# Altium schematic sheet Analog_Section.SchDoc
size 353 x 250 mm; Date: 17.10.2024r.; Author: Bartłomiej Smoter; CompanyName: AGH Racing; Revision: v1; SheetNumber: 5; SheetTotal: 6
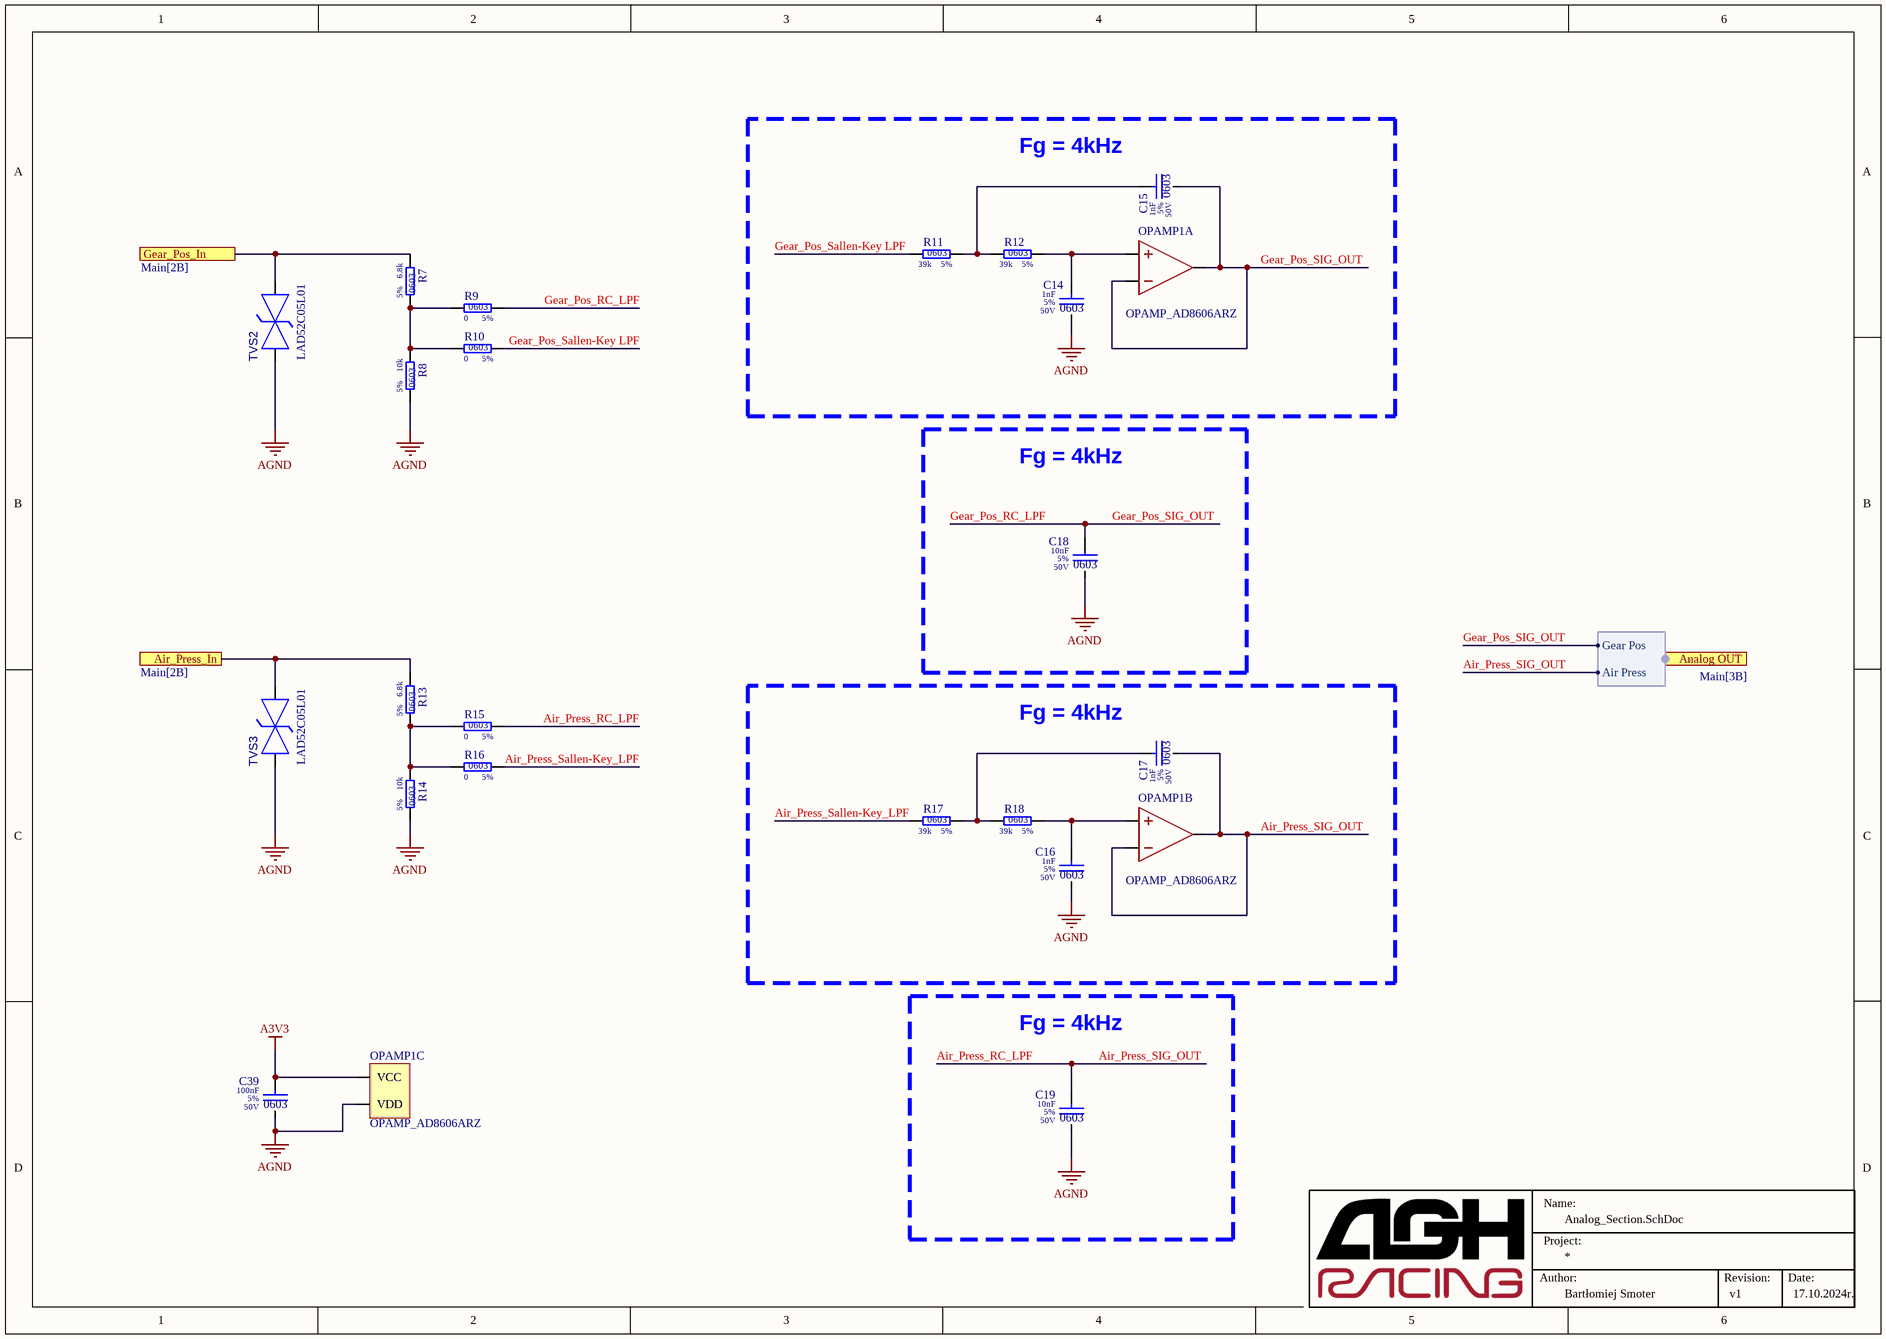
[diagram p0: Analog_Section.SchDoc]

## Parts
C14  value 1nF  Tolerance: 5%  Voltage Rating: 50V  Case/Package: 0603  [0603_HandSold_Capacitor]  (hidden comment: C_1n_50V_0603_5)
C15  value 1nF  Tolerance: 5%  Voltage Rating: 50V  Case/Package: 0603  [0603_HandSold_Capacitor]  (hidden comment: C_1n_50V_0603_5)
C16  value 1nF  Tolerance: 5%  Voltage Rating: 50V  Case/Package: 0603  [0603_HandSold_Capacitor]  (hidden comment: C_1n_50V_0603_5)
C17  value 1nF  Tolerance: 5%  Voltage Rating: 50V  Case/Package: 0603  [0603_HandSold_Capacitor]  (hidden comment: C_1n_50V_0603_5)
C18  value 10nF  Tolerance: 5%  Voltage Rating: 50V  Case/Package: 0603  [0603_HandSold_Capacitor]  (hidden comment: C_10n_50V_0603_5)
C19  value 10nF  Tolerance: 5%  Voltage Rating: 50V  Case/Package: 0603  [0603_HandSold_Capacitor]  (hidden comment: C_10n_50V_0603_5)
C39  value 100nF  Tolerance: 5%  Voltage Rating: 50V  Case/Package: 0603  [0603_HandSold_Capacitor]  (hidden comment: C_100n_50V_0603_5)
OPAMP1  OPAMP_AD8606ARZ  [SOIC-8]  (parts A,B,C of 3)
R7  Tolerance: 5%  Resistance: 6.8k  Case/Package: 0603  [0603_HandSold_Resistor]  (hidden comment: R_6.8k_0603_5)
R8  Tolerance: 5%  Resistance: 10k  Case/Package: 0603  [0603_HandSold_Resistor]  (hidden comment: R_10k_0603_5)
R9  Tolerance: 5%  Resistance: 0  Case/Package: 0603  [0603_HandSold_Resistor]  (hidden comment: R_0_0603_5)
R10  Tolerance: 5%  Resistance: 0  Case/Package: 0603  [0603_HandSold_Resistor]  (hidden comment: R_0_0603_5)
R11  Tolerance: 5%  Resistance: 39k  Case/Package: 0603  [0603_HandSold_Resistor]  (hidden comment: R_39k_0603_5)
R12  Tolerance: 5%  Resistance: 39k  Case/Package: 0603  [0603_HandSold_Resistor]  (hidden comment: R_39k_0603_5)
R13  Tolerance: 5%  Resistance: 6.8k  Case/Package: 0603  [0603_HandSold_Resistor]  (hidden comment: R_6.8k_0603_5)
R14  Tolerance: 5%  Resistance: 10k  Case/Package: 0603  [0603_HandSold_Resistor]  (hidden comment: R_10k_0603_5)
R15  Tolerance: 5%  Resistance: 0  Case/Package: 0603  [0603_HandSold_Resistor]  (hidden comment: R_0_0603_5)
R16  Tolerance: 5%  Resistance: 0  Case/Package: 0603  [0603_HandSold_Resistor]  (hidden comment: R_0_0603_5)
R17  Tolerance: 5%  Resistance: 39k  Case/Package: 0603  [0603_HandSold_Resistor]  (hidden comment: R_39k_0603_5)
R18  Tolerance: 5%  Resistance: 39k  Case/Package: 0603  [0603_HandSold_Resistor]  (hidden comment: R_39k_0603_5)
TVS2  Man. Part Num.: LAD52C05L01  [SOD-523-2_ALT]  (hidden comment: TVS_LAD52C05L01)
TVS3  Man. Part Num.: LAD52C05L01  [SOD-523-2_ALT]  (hidden comment: TVS_LAD52C05L01)

## Blocks framed on the sheet
Fg = 4kHz: C14 C15 OPAMP1 R11 R12
Fg = 4kHz: C18
Fg = 4kHz: C16 C17 OPAMP1 R17 R18
Fg = 4kHz: C19

## Ports
Air_Press_In (see Main[2B]), Analog OUT (harness ANAL, see Main[3B]), Gear_Pos_In (see Main[2B])

## Harnesses
ANAL: Gear Pos, Air Press

## Nets
A3V3: C39.1 OPAMP1.8(VCC)
AGND: C14.2 C16.2 C18.2 C19.2 C39.2 OPAMP1.4(VDD) R8.2 R14.2 TVS2.1 TVS3.1
Air_Press_In: R13.1 TVS3.2 ; port Air_Press_In
Air_Press_RC_LPF: C17.2 C19.1 OPAMP1.6(2IN-) OPAMP1.7(2OUT) R15.2 ; port Analog OUT.Air Press  [also labelled Air_Press_SIG_OUT]
Air_Press_Sallen-Key_LPF: R16.2 R17.1
Gear_Pos_In: R7.1 TVS2.2 ; port Gear_Pos_In
Gear_Pos_RC_LPF: C15.2 C18.1 OPAMP1.1(1OUT) OPAMP1.2(1IN-) R9.2 ; port Analog OUT.Gear Pos  [also labelled Gear_Pos_SIG_OUT]
Gear_Pos_Sallen-Key LPF: R10.2 R11.1
NetC14_1: C14.1 OPAMP1.3(1IN+) R12.2
NetC15_1: C15.1 R11.2 R12.1
NetC16_1: C16.1 OPAMP1.5(2IN+) R18.2
NetC17_1: C17.1 R17.2 R18.1
NetR7_2: R7.2 R8.1 R9.1 R10.1
NetR13_2: R13.2 R14.1 R15.1 R16.1

## Notes on the sheet
- Name:
- Author:
- Project:
- Revision:
- Date:

## Library data of the parts
C14-C17 = CMP-001-00012-23: Capacitor Type: Ceramic; Revision Num.: 1; Mounting Technology: SMT; HelpURL: https://www.tme.eu/Document/c9f83032181d562eecbad103d884e6f2/C0603C102J5RACTU.pdf
C18 C19 = CMP-001-00009-26: Revision Num.: 1; Capacitor Type: Ceramic; Mounting Technology: SMT; HelpURL: https://www.tme.eu/Document/78f46414e6dac38b7cca12338ea208b0/X7RDielectric.pdf
C39 = CMP-001-00008-26: Capacitor Type: Ceramic; Revision Num.: 1; HelpURL: https://www.tme.eu/Document/78f46414e6dac38b7cca12338ea208b0/X7RDielectric.pdf; Mounting Technology: SMT
OPAMP1 = CMP-014-00019-1: Precision Amplifiers DUAL, PRECISION CMOS RAIL-RAIL OP AMP, GBP - 10MHz, SR - 5V/us, Vos - 20mV, Ib - 250pA; Max Supply Voltage: 5V; Channels: 2; Power: 1.25W; Min Supply Voltage: 2.7V; HelpURL: https://www.mouser.pl/datasheet/2/609/AD8605_8606_8608-1716254.pdf; Mounting Technology: SMT; Man. Part Num.: AD8606ARZ; Case/Package: SOIC-8
R7 R13 = CMP-009-00043-18: Power: 100mW; Voltage Rating: 50V; Revision Num.: 1; Mounting Technology: SMT; HelpURL: https://www.mouser.pl/datasheet/2/54/cr-1858361.pdf
R8 R14 = CMP-009-00002-20: Power: 100mW; Voltage Rating: 50V; Revision Num.: 1; HelpURL: https://www.tme.eu/Document/d2a72e545e5c8eb7bf2a04fa97535928/rc0603yageo.pdf; Mounting Technology: SMT
R9 R10 R15 R16 = CMP-009-00016-19: Revision Num.: 1; Power: 100mW; Voltage Rating: 50V; HelpURL: https://www.tme.eu/Document/c283990e907c122bb808207d1578ac7f/POWER_RATING-DTE.pdf; Mounting Technology: SMT
R11 R12 R17 R18 = CMP-009-00157-1: Voltage Rating: 75V; Power: 100mW; Revision Num.: 1; HelpURL: https://www.mouser.pl/datasheet/2/315/AOA0000C301-1488782.pdf; Mounting Technology: SMT
TVS2 TVS3 = CMP-004-00007-6: Diode; TVS; 5V 5.6V 9.8V; Polarity: Bidirectional; Revision Num.: 1; Mounting Technology: SMT; Breakdown Voltage: 5.6V; Case/Package: SOD-523; HelpURL: https://eu.mouser.com/datasheet/2/447/LAD52CXXL01_1-3003079.pdf; Working Voltage: 5V; Clamping Voltage: 9.8V